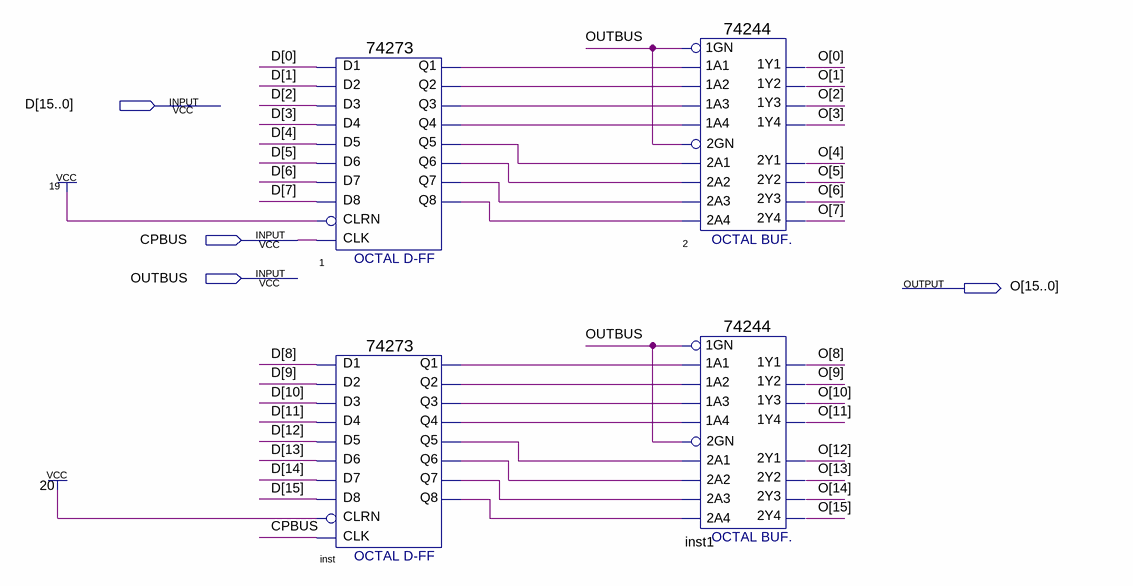
[diagram p0: schematic sheet]
// Quartus schematic BUSLATCH.bdf as structural Verilog: 4 symbols, 4 pins
module BUSLATCH (
  input  [15:0] D,
  input  CPBUS,
  input  OUTBUS,
  output [15:0] O
);

  wire inst_q1, inst_q2, inst_q3, inst_q4, inst_q5, inst_q6, inst_q7, inst_q8, n1_q1, n1_q2, n1_q3, n1_q4,
       n1_q5, n1_q6, n1_q7, n1_q8;

  \74273  u_1 (
    .D1(D[0]), .D2(D[1]), .D3(D[2]), .D4(D[3]), .D5(D[4]), .D6(D[5]), .D7(D[6]), .CLK(CPBUS), .D8(D[7]),
    .CLRN(1'b1), .Q1(n1_q1), .Q2(n1_q2), .Q3(n1_q3), .Q4(n1_q4), .Q5(n1_q5), .Q6(n1_q6), .Q7(n1_q7),
    .Q8(n1_q8));
  \74273  inst (
    .D2(D[9]), .D3(D[10]), .D1(D[8]), .D4(D[11]), .D7(D[14]), .D6(D[13]), .D5(D[12]), .D8(D[15]),
    .CLK(CPBUS), .CLRN(1'b1), .Q4(inst_q4), .Q1(inst_q1), .Q2(inst_q2), .Q3(inst_q3), .Q6(inst_q6),
    .Q5(inst_q5), .Q7(inst_q7), .Q8(inst_q8));
  \74244  u_2 (
    .\1A2 (n1_q2), .\1A1 (n1_q1), .\1A4 (n1_q4), .\1A3 (n1_q3), .\1GN (OUTBUS), .\2A1 (n1_q5),
    .\2GN (OUTBUS), .\2A3 (n1_q7), .\2A2 (n1_q6), .\2A4 (n1_q8), .\1Y2 (O[1]), .\1Y1 (O[0]), .\2Y1 (O[4]),
    .\1Y4 (O[3]), .\1Y3 (O[2]), .\2Y4 (O[7]), .\2Y3 (O[6]), .\2Y2 (O[5]));
  \74244  inst1 (
    .\1A2 (inst_q2), .\1A4 (inst_q4), .\1A1 (inst_q1), .\1A3 (inst_q3), .\1GN (OUTBUS), .\2A3 (inst_q7),
    .\2GN (OUTBUS), .\2A1 (inst_q5), .\2A4 (inst_q8), .\2A2 (inst_q6), .\1Y2 (O[9]), .\1Y4 (O[11]),
    .\2Y1 (O[12]), .\1Y1 (O[8]), .\2Y3 (O[14]), .\2Y4 (O[15]), .\1Y3 (O[10]), .\2Y2 (O[13]));
endmodule
